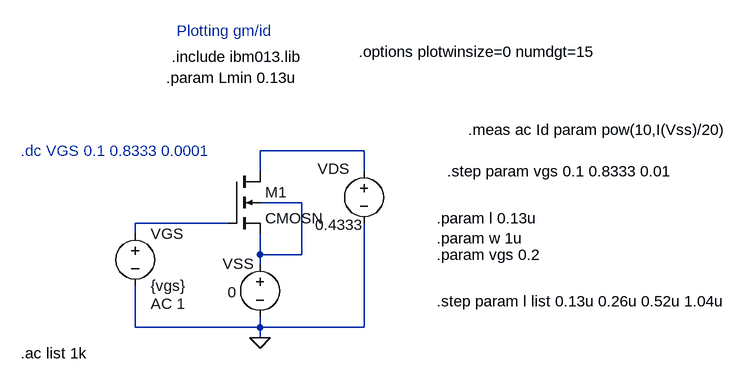
[diagram p0: schematic Plot gm over id.asc]
Plot gm over id.asc, the LTspice schematic file:
Version 4
SHEET 1 1164 680
WIRE 272 16 112 16
WIRE 112 48 112 16
WIRE 272 48 272 16
WIRE 176 96 112 96
WIRE 64 128 -80 128
WIRE -80 144 -80 128
WIRE 112 176 112 144
WIRE 176 176 176 96
WIRE 176 176 112 176
WIRE 112 192 112 176
WIRE -80 288 -80 224
WIRE 112 288 112 272
WIRE 112 288 -80 288
WIRE 272 288 272 128
WIRE 272 288 112 288
WIRE 112 304 112 288
FLAG 112 304 0
SYMBOL cmosn 64 48 R0
SYMATTR InstName M1
SYMATTR Value2 l={l} w={w} ad={2*Lmin*w} as={2*Lmin*w} pd={2*(2*Lmin+w)} ps={2*(2*Lmin+w)}
SYMBOL voltage -80 128 R0
WINDOW 123 24 124 Left 2
WINDOW 39 0 0 Left 0
SYMATTR Value2 AC 1
SYMATTR InstName VGS
SYMATTR Value {vgs}
SYMBOL voltage 272 32 R0
WINDOW 0 -71 12 Left 2
WINDOW 3 -75 98 Left 2
SYMATTR InstName VDS
SYMATTR Value 0.4333
SYMBOL voltage 112 176 R0
WINDOW 0 -57 14 Left 2
WINDOW 3 -50 58 Left 2
SYMATTR InstName VSS
SYMATTR Value 0
TEXT -16 -168 Left 2 ;Plotting gm/id
TEXT -24 -128 Left 2 !.include ibm013.lib
TEXT -32 -96 Left 2 !.param Lmin 0.13u
TEXT -256 16 Left 2 ;.dc VGS 0.1 0.8333 0.0001
TEXT 384 120 Left 2 !.param l 0.13u\n.param w 1u
TEXT 264 -136 Left 2 !.options plotwinsize=0 numdgt=15
TEXT 400 48 Left 2 !.step param vgs 0.1 0.8333 0.01
TEXT -256 328 Left 2 !.ac list 1k
TEXT 384 248 Left 2 !.step param l list 0.13u 0.26u 0.52u 1.04u
TEXT 432 -16 Left 2 !.meas ac Id param pow(10,I(Vss)/20)
TEXT 384 176 Left 2 !.param vgs 0.2

The netlist it stands for:
* Plot gm over id.asc
M1 N001 N003 N002 N002 CMOSN l={l} w={w} ad={2*Lmin*w} as={2*Lmin*w} pd={2*(2*Lmin+w)} ps={2*(2*Lmin+w)}
VGS N003 0 {vgs} AC 1
VDS N001 0 0.4333
VSS N002 0 0
.model NMOS NMOS
.model PMOS PMOS
.lib standard.mos
* Plotting gm/id
.include ibm013.lib
.param Lmin 0.13u
* .dc VGS 0.1 0.8333 0.0001
.param l 0.13u
.param w 1u
.options plotwinsize=0 numdgt=15
.step param vgs 0.1 0.8333 0.01
.ac list 1k
.step param l list 0.13u 0.26u 0.52u 1.04u
.meas ac Id param pow(10,I(Vss)/20)
.param vgs 0.2
.backanno
.end